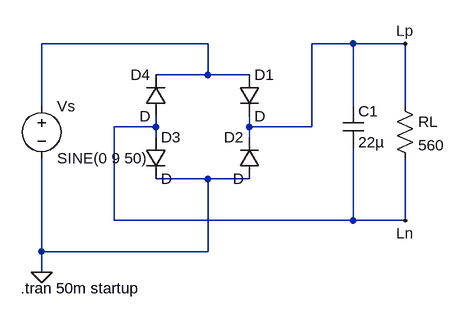
[diagram p0: schematic lab2.3a.asc]
lab2.3a.asc, the LTspice schematic file:
Version 4
SHEET 1 880 680
WIRE 144 -32 -112 -32
WIRE 368 -32 304 -32
WIRE 448 -32 368 -32
WIRE 144 16 144 -32
WIRE 144 16 64 16
WIRE 208 16 144 16
WIRE -112 64 -112 -32
WIRE 368 64 368 -32
WIRE 448 64 448 -32
WIRE 64 96 64 80
WIRE 64 96 0 96
WIRE 208 96 208 80
WIRE 304 96 304 -32
WIRE 304 96 208 96
WIRE 64 112 64 96
WIRE 208 112 208 96
WIRE 144 176 64 176
WIRE 208 176 144 176
WIRE 0 240 0 96
WIRE 368 240 368 128
WIRE 368 240 0 240
WIRE 448 240 448 144
WIRE 448 240 368 240
WIRE -112 288 -112 144
WIRE 144 288 144 176
WIRE 144 288 -112 288
WIRE -112 320 -112 288
FLAG 448 -32 Lp
FLAG 448 240 Ln
FLAG -112 320 0
SYMBOL diode 224 176 R180
WINDOW 0 24 64 Left 2
WINDOW 3 24 0 Left 2
SYMATTR InstName D2
SYMBOL diode 48 112 R0
SYMATTR InstName D3
SYMBOL diode 80 80 R180
WINDOW 0 24 64 Left 2
WINDOW 3 24 0 Left 2
SYMATTR InstName D4
SYMBOL diode 192 16 R0
SYMATTR InstName D1
SYMBOL voltage -112 48 R0
WINDOW 123 0 0 Left 0
WINDOW 39 0 0 Left 0
SYMATTR InstName Vs
SYMATTR Value SINE(0 9 50)
SYMBOL res 432 48 R0
SYMATTR InstName RL
SYMATTR Value 560
SYMBOL cap 352 64 R0
SYMATTR InstName C1
SYMATTR Value 22µ
SYMATTR SpiceLine Rser=20
TEXT -144 344 Left 2 !.tran 50m startup

The netlist it stands for:
* lab2.3a.asc
D2 0 Lp D
D3 Ln 0 D
D4 Ln N001 D
D1 N001 Lp D
Vs N001 0 SINE(0 9 50)
RL Lp Ln 560
C1 Lp Ln 22µ Rser=20
.model D D
.lib standard.dio
.tran 50m startup
.backanno
.end